# EAGLE design Adafruit Feather 328P (EAGLE 9.6.2)
COMPANY: ADAFRUIT INDUSTRIES; DRAWN: KTOWN; REV: B
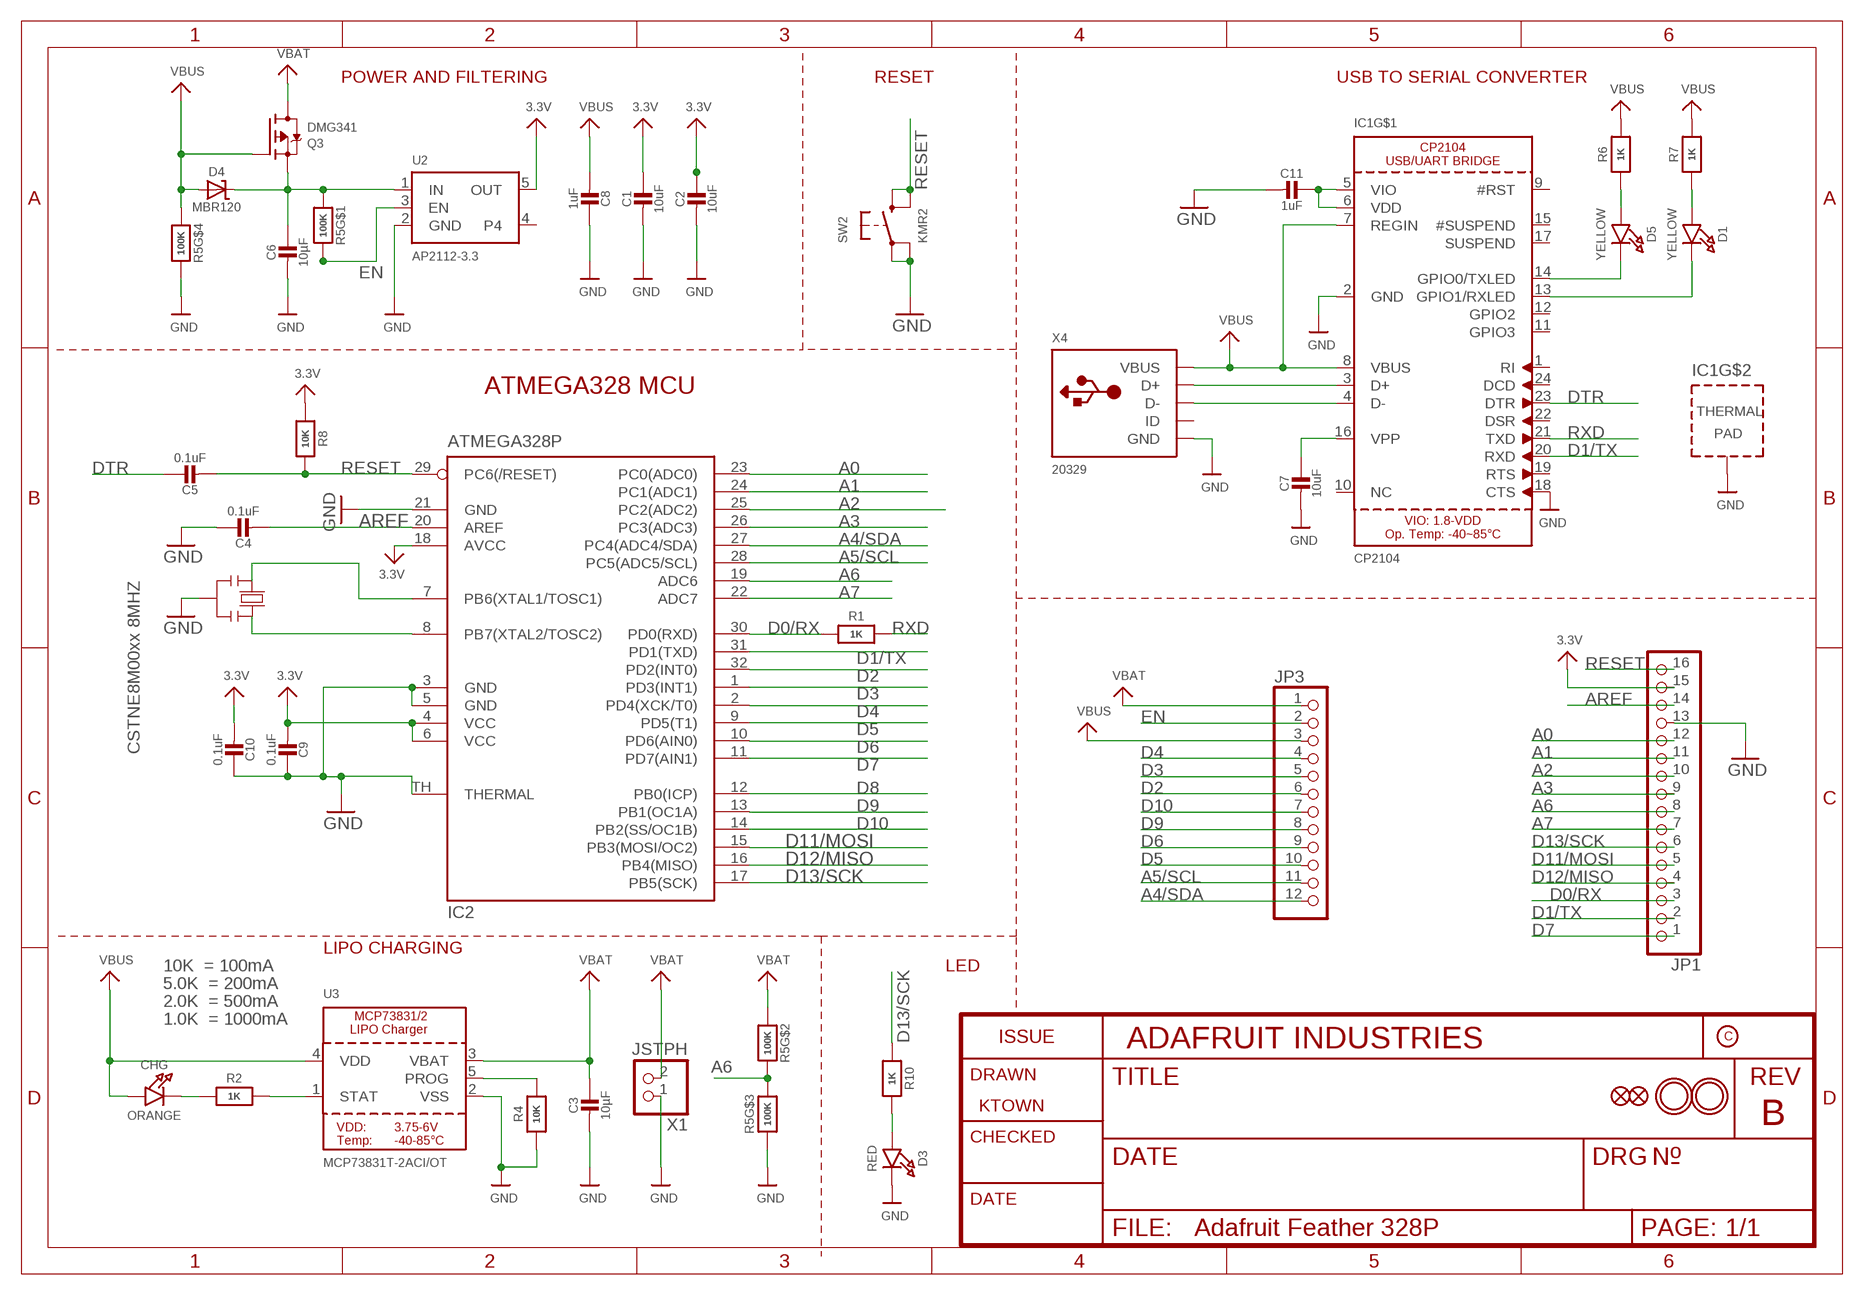
[diagram p0: schematic, sheet 1]

## Parts
C1  10uF  CAP_CERAMIC0805-NOOUTLINE  [0805-NO]
C2  10uF  CAP_CERAMIC0805-NOOUTLINE  [0805-NO]
C3  10µF  CAP_CERAMIC0805-NOOUTLINE  [0805-NO]
C4  0.1uF  CAP_CERAMIC0603_NO  [0603-NO]
C5  0.1uF  CAP_CERAMIC0603_NO  [0603-NO]
C6  10µF  CAP_CERAMIC0805-NOOUTLINE  [0805-NO]
C7  10uF  CAP_CERAMIC_0805MP  [_0805MP]
C8  1uF  CAP_CERAMIC0603_NO  [0603-NO]
C9  0.1uF  CAP_CERAMIC0603_NO  [0603-NO]
C10  0.1uF  CAP_CERAMIC0603_NO  [0603-NO]
C11  1uF  CAP_CERAMIC0603_NO  [0603-NO]
CHG  ORANGE  LED0805_NOOUTLINE  [CHIPLED_0805_NOOUTLINE]
D1  YELLOW  LED0805_NOOUTLINE  [CHIPLED_0805_NOOUTLINE]
D3  RED  LED0805_NOOUTLINE  [CHIPLED_0805_NOOUTLINE]
D4  MBR120  DIODE-SCHOTTKYSOD-123  [SOD-123]
D5  YELLOW  LED0805_NOOUTLINE  [CHIPLED_0805_NOOUTLINE]
IC1  CP2104  [QFN24_4MM_SMSC]
IC2  ATMEGA328P  MEGA8-MI  [MLF32-TH]
JP1  HEADER-1X16ROUND  [1X16_ROUND]
JP3  HEADER-1X12  [1X12_ROUND]
Q3  DMG341  MOSFET-P  [SOT23-R]
R1  1K  RESISTOR_0603MP  [_0603MP]
R2  1K  RESISTOR_0603_NOOUT  [0603-NO]
R4  10K  RESISTOR_0603_NOOUT  [0603-NO]
R5  100K  RESISTOR_4PACK  [RESPACK_4X0603]
R6  1K  RESISTOR_0603_NOOUT  [0603-NO]
R7  1K  RESISTOR_0603_NOOUT  [0603-NO]
R8  10K  RESISTOR_0603_NOOUT  [0603-NO]
R10  1K  RESISTOR_0603_NOOUT  [0603-NO]
SW2  KMR2  SWITCH_TACT_SMT4.6X2.8  [BTN_KMR2_4.6X2.8]
U2  AP2112-3.3  VREG_SOT23-5  [SOT23-5]
U3  MCP73831T-2ACI/OT  MCP73831/2  [SOT23-5]
U$31  MOUNTINGHOLE2.5  [MOUNTINGHOLE_2.5_PLATED]
U$32  MOUNTINGHOLE2.5  [MOUNTINGHOLE_2.5_PLATED]
U$34  FIDUCIAL_1MM  [FIDUCIAL_1MM]
U$35  FIDUCIAL_1MM  [FIDUCIAL_1MM]
X1  JSTPH  CON_JST_PH_2PIN  [JSTPH2]
X4  20329  USB_MICRO_20329_V2  [4UCONN_20329_V2]
Y2  CSTNE8M00xx 8MHZ  RESONATORMU  [RESONATOR]

## Nets
3.3V: C1.1 C2.1 C9.2 C10.2 IC2.4(VCC) IC2.6(VCC) IC2.18(AVCC) JP1.15 R8.2 U2.5(OUT)
A0: IC2.23(PC0(ADC0)) JP1.12
A1: IC2.24(PC1(ADC1)) JP1.11
A2: IC2.25(PC2(ADC2)) JP1.10
A3: IC2.26(PC3(ADC3)) JP1.9
A4/SDA: IC2.27(PC4(ADC4/SDA)) JP3.12
A5/SCL: IC2.28(PC5(ADC5/SCL)) JP3.11
A6: IC2.19(ADC6) JP1.8 R5.6 R5.7
A7: IC2.22(ADC7) JP1.7
AREF [aref]: C4.2 IC2.20(AREF) JP1.14
D0/RX: IC2.30(PD0(RXD)) JP1.3 R1.1
D1/TX: IC1.20(RXD) IC2.31(PD1(TXD)) JP1.2
D2: IC2.32(PD2(INT0)) JP3.6
D3: IC2.1(PD3(INT1)) JP3.5
D4: IC2.2(PD4(XCK/T0)) JP3.4
D5: IC2.9(PD5(T1)) JP3.10
D6: IC2.10(PD6(AIN0)) JP3.9
D7: IC2.11(PD7(AIN1)) JP1.1
D8: IC2.12(PB0(ICP))
D9: IC2.13(PB1(OC1A)) JP3.8
D10: IC2.14(PB2(SS/OC1B)) JP3.7
D11/MOSI: IC2.15(PB3(MOSI/OC2)) JP1.5
D12/MISO: IC2.16(PB4(MISO)) JP1.4
D13/SCK: IC2.17(PB5(SCK)) JP1.6 R10.1
DTR: C5.1 IC1.23(DTR)
EN: JP3.2 R5.8 U2.3(EN)
GND: C1.2 C2.2 C3.2 C4.1 C6.2 C7.2 C8.1 C9.1 C10.1 C11.2 D3.C IC1.2(GND) IC1.18(CTS) IC1.THERM(TP) IC2.3(GND) IC2.5(GND) IC2.21(GND) IC2.TH(THERMAL) JP1.13 R4.1 R5.3 R5.5 SW2.A'(P1) SW2.A(P) U2.2(GND) U3.2(VSS) X1.1 X4.BASE@1(GND) X4.BASE@2(GND) X4.GND X4.SPRT@1(GND) X4.SPRT@2(GND) X4.SPRT@3(GND) X4.SPRT@4(GND) Y2.2
N$1: CHG.C R2.1
N$2: IC1.3(D+) X4.D+
N$3: R2.2 U3.1(STAT)
N$4: R4.2 U3.5(PROG)
N$5: D3.A R10.2
N$6: IC1.4(D-) X4.D-
N$7: C6.1 D4.C Q3.2(S) R5.1 U2.1(IN)
N$8: D1.A R7.1
N$9: D5.A R6.1
N$10: C11.1 IC1.5(VIO) IC1.6(VDD)
N$41: C7.1 IC1.16(VPP)
RESET: C5.2 IC2.29(PC6(/RESET)) JP1.16 R8.1 SW2.B'(S1) SW2.B(S)
RXD: IC1.21(TXD) R1.2
RXLED: D1.C IC1.13(GPIO1/RXLED)
TXLED: D5.C IC1.14(GPIO0/TXLED)
VBAT: C3.1 JP3.1 Q3.3(D) R5.2 U3.3(VBAT) X1.2
VBUS: C8.2 CHG.A D4.A IC1.7(REGIN) IC1.8(VBUS) JP3.3 Q3.1(G) R5.4 R6.2 R7.2 U3.4(VDD) X4.VBUS
XTAL1: IC2.8(PB7(XTAL2/TOSC2)) Y2.3
XTAL2: IC2.7(PB6(XTAL1/TOSC1)) Y2.1
Unconnected: IC1.1(RI) IC1.9(#RST) IC1.10(NC) IC1.11(GPIO3) IC1.12(GPIO2) IC1.15(#SUSPEND) IC1.17(SUSPEND) IC1.19(RTS) IC1.22(DSR) IC1.24(DCD) U2.4 X4.ID

## Notes on the sheet
- POWER AND FILTERING | RESET | USB TO SERIAL CONVERTER
- ATMEGA328 MCU
- LIPO CHARGING
- 10K  = 100mA | LED
- 5.0K  = 200mA
- 2.0K  = 500mA
- 1.0K  = 1000mA

## Library data of the parts
C1-C11 = microbuilder:CAP_CERAMIC: Ceramic Capacitors For new designs, use the packages preceded by an '_' character since they are more reliable: The following footprints should be used on most boards: _0402 - Standard footprint for regular board layouts _0603 - Standard footprint for regular board layouts _0805 - Standard footprint for regular board layouts _1206 - Standard footprint for regular board layouts For extremely tight-pitch boards where space is at a premium, the following 'micro-pitch' footprints can be used (smaller pads, no silkscreen outline, etc.): _0402MP - Micro-pitch footprint for very dense/compact boards _0603MP - Micro-pitch footprint for very dense/compact boards _0805MP - Micro-pitch footprint for very dense/compact boards _1206MP - Micro-pitch footprint for very dense/compact boards
CHG D1 D3 D5 = microbuilder:LED: LED 0603 - 0603 Surface Mount Package 2mA: Green LED - Low Power (3.9mcd, 2ma, 1.7Vf) - Digikey: 475-2709-2-ND Orange LED - Low Power (9.8mcd, 2ma, 1.8Vf) - Digikey: 475-1194-2-ND Red LED - Low Power (5mcd, 2ma, 1.8Vf) - Digikey: 475-1195-2-ND Yellow LED - Low Power (7mcd, 2ma, 1.8Vf) - Digikey: 475-1196-2-ND 5mA: Blue LED - Low Power (17mcd, 5ma, 2.9Vf) - Digikey: LNJ937W8CRACT-ND 0805 - 0805 Surface Mount Package 2mA: Red LED (8.8mcd, 2mA, 1.8Vf, Clear) - Low Power [Digikey: 475-2510-1-ND] Green LED (5mcd, 2mA, 1.8Vf, Clear) - Low Power [Digikey: 475-2730-1-ND] Yellow LED (11.3mcd, 2mA, 1.8Vf, Clear) - Low Power [Digikey: 475-2555-1-ND] 20mA: Red LED (104mcd, 20mA, Diffused) - LS R976 [Digikey: 475-1278-6-ND] Red LED (12mcd, 20mA, 2.0Vf, Clear) - APT2012EC [Digikey: 754-1128-1-ND] Green LED (15mcd, 20mA, 2.2Vf, Clear) - APT2012GC [Digikey: 754-1131-1-ND] Orange LED (160mcd, 20mA, 2.1Vf, Clear) - APT2012SECK [Digikey: 754-1130-1-ND] 1206 - 1206 Surface Mount Package Green LED (26mcd, 20mA, Diffused) - LG N971 [Digikey: 475-1407-6-ND] Red LED (15mcd, 20mA, Diffused) - LH N974 [Digikey: 475-1416-6-ND] Cree - Cree High-Power Surface Mount LEDs XPEBWT-L1-0000-00D50 - White 111lm 350mA 2.9Vf 6200K 110° XTEAWT-00-0000-00000LEE3 - White 114lm 350mA 2.85Vf 5000K 115° Everlight - Everlight 45-21 Series Surface Mount LEDs 45-21/QK2C-B2832AC2CB2/2T - Warm White 2000mcd 20mA 3.25Vf 3050K 120° 45-21/LK2C-B38452C4CB2/2T - Nuetral White 2000mcd 20mA 3.25Vf 4150K 120° 45-21/LK2C-B50634C6CB2/2T - Cold White 2200mcd 20mA 3.25Vf 5650K 120° PLCC2 Reverse Mount LS T77K-J1L2-1-0-2-R18-Z - Red 11.25mcd 2mA 1.8Vf 630nm 120° LO T77K-L1M2-24-Z - Orange 19.6mcd 2mA 1.8Vf 606nm 120° LY T77K-K2M1-26-Z - Yellow 15.7mcd 2mA 1.8Vf 587nm 120°
D4 = microbuilder:DIODE-SCHOTTKY
IC1 = microbuilder:CP2104: CP2104 - USB to UART Bridge VDD Output: 3.45V
IC2 = microbuilder:MEGA8-MI: MICROCONTROLLER 8 Kbytes FLASH, 1 kbytes SRAM, 512 bytes EEPROM, USART, 6-channel 10 bit ADC, 2-channel 8 bit ADC Pin compatible with Atmega48, ATMega88, ATMega168 Source: avr.lbr; MPN: ATMEGA88PA-MU; OC_FARNELL: 1715491; OC_NEWARK: 15R0272
JP1 = microbuilder:HEADER-1X16: PIN HEADER
JP3 = microbuilder:HEADER-1X12
Q3 = microbuilder:MOSFET-P: P-Channel Mosfet LEGEND VDS: Voltage Drain-Source ID: Drain Current RDS(ON): Drain-Source On-State Resistance VGS(TH): Gate-Source Threshold Voltage CISS: Drain-Source Input Capacitance SOT-23 Name VDS ID RDS(ON) VGS(TH) CISS Order Number IRLML5103 30V 760mA 600 mOhm -- 75pF @ 25V Digikey: IRLML5103PBFCT-ND IRLML6401 12V 4.3A 50 mOhm 950mV @ 250µA 830pF @ 10V Digikey: IRLML6401PBFTR-ND NTR0202PL 20V 400mA 800 mOhm 2.3V @ 250uA 70pF @ 5V Digikey: NTR0202PLT1GOSTR-ND NTR4101PT1G 20V 1.8A 85 mOhm 1.2V @ 250uA 675pF @ 10V Digikey: NTR4101PT1GOSCT-ND DMP2004K 20V 600mA 900 mOhm 1V @ 250uA 175pF @ 16V Digikey: DMP2004KDICT-ND PMV65XP 20V 3.9A 76 mOhm 950mV @ 1mA 725pF @ 20V Digikey: 568-2358-2-ND TO-252 Name VDS ID RDS(ON) VGS(TH) CISS Order Number AOD417 30V 25A 34 mOhm 3V @ 250µA 920pF @ 15V Digikey: 785-1106-2-ND PowerPak Name VDS ID RDS(ON) VGS(TH) CISS Order Number AON7401 30V 12A 14 mOhm 3V @ 250µA 2600pF @ 15V Digikey: 785-1302-1-ND
R1 R2 R4 R6-R8 R10 = microbuilder:RESISTOR: Resistors For new designs, use the packages preceded by an '_' character since they are more reliable: The following footprints should be used on most boards: _0402 - Standard footprint for regular board layouts _0603 - Standard footprint for regular board layouts _0805 - Standard footprint for regular board layouts _1206 - Standard footprint for regular board layouts For extremely tight-pitch boards where space is at a premium, the following 'micro-pitch' footprints can be used (smaller pads, no silkscreen outline, etc.): _0402MP - Micro-pitch footprint for very dense/compact boards _0603MP - Micro-pitch footprint for very dense/compact boards _0805MP - Micro-pitch footprint for very dense/compact boards _1206MP - Micro-pitch footprint for very dense/compact boards
R5 = microbuilder:RESISTOR_4PACK: Resistor Packs (4 resistors) 4 x 0603 10K 1/16W - Digikey: YC164J-10KCT-ND
SW2 = microbuilder:SWITCH_TACT_SMT: SMT Tact Switches 6x6mm - Digikey: P12940SCT-ND KMR2 (4.6x2.8mm) - Digikey: 401-1426-1-ND EVQ-PQHB55 - Light Touch, 160GF (4.5x4.5mm) - Digikey: P8090SCT-ND KMT0 - KMT021 NGJ LHS (etc.) IP68/Waterproof - Digikey: CKN10289CT-ND
U2 = microbuilder:VREG_SOT23-5: SOT23-5 Fixed Voltage Regulators Part Current Out V Out V In V Dropout θJA (°C/W) TJ (°C) Digikey Part No. ADP121 150mA 3.3V 3.4-5.5V 0.09V @ 150mA -- -- ADP121-AUJZ33R7CT-ND ADP121 150mA 3.0V 3.1-5.5V 0.09V @ 150mA -- -- ADP121-AUJZ30R7CT-ND ADP122 300mA 3.3V 3.4-5.5V 0.085V @ 300mA -- -- ADP122AUJZ-3.3-R7CT-ND ADP1712 300mA 3.3V 3.5-5.5V 0.17V @ 300mA -- -- ADP1712AUJZ-3.3-R7TR-ND AP7311 (Low Cost) 150mA 3.3V 3.5-6V 0.15V @ 150mA -- -- AP7311-33WG-7DICT-ND LD39015M18R 150mA 1.8V 1.9V-5.5V 0.08V @ 100mA -- -- 497-6977-1-ND LP2985A-33DBVR 150mA 3.3V 3.3-16V 0.28V @ 150mA 206 150 296-18479-1-ND MCP1824T-3302E/OT 300mA 3.3V 3.5V-6V 0.2V @ 300mA -- -- MCP1824T-3302E/OTCT-ND MIC5205-2.5YM5 TR 150mA 2.5V 2.7-16V 0.165V @ 150mA -- -- 576-1257-2-ND MIC5205-3.0YM5 TR 150mA 3.0V 3.2V-16V 0.165V @ 150mA -- -- 576-1258-2-ND MIC5205-3.3YM5 TR 150mA 3.3V 3.5V-16V 0.165V @ 150mA -- -- 576-1259-2-ND TPS780330220 150mA 3.3V+2.2V 3.6-5.5V 250mV Max -- -- 296-23332-1-ND TDA3663/N1,135 100mA 3.3V 3.5-45V 0.18V @ 50mA -- -- 568-5343-1-ND Max operating temp can be calculated using θJA, TJ (max junction temperature), and power in watts. Set the "Maximum Ambient Temperature" until it reaches TJ ("Max Junction Temperature"), which is the absolute limit for safe use of the regulator: Heat Sink Temperature Calculator <http://www.daycounter.com/Calculators/Heat-Sink-Temperature-Calculator.phtml> For example, With 12V source into a 3.3V LP2985 and a 30mA load, we are dissipating (12V-3.3V) * 0.03A = 0.261W. With a θJA of 206 °C/W, a TJ of 150°C, and 261mW we can safely use the chip without a heat sink up to 75°C (=147.1°C Junction Temperature).
U3 = microbuilder:MCP73831/2: MCP73831/2 LIPO Charger VDD: 3.75 - 6V Temp -40 - 85°C Programmable Charge Rate: 15-500mA NOTE: STAT is a tri-state logic output on the MCP73831 and an open-drain output on the MCP73832. SOT23-5 with 4.2V output and tri-state logic on STAT = MCP73831T-2ACI/OT
U$31 U$32 = microbuilder:MOUNTINGHOLE: Mounting Hole For #2 screws (0.086"/2.18mm width, 0.094"/2.4mm hole) use 2.5mm; BOM: EXCLUDE
U$34 U$35 = microbuilder:FIDUCIAL: Fiducial Alignment Points Various fiducial points for machine vision alignment.; BOM: EXCLUDE
X1 = microbuilder:CON_JST_PH_2PIN: JST 2-Pin Right-Angle Connector PH-Series - 4UConnector: 17311 SH-Series - 4UConnector: 07278
X4 = microbuilder:USB: USB Connectors USBMINIB - Surface Mount Female Mini-B USB Connector 4UConnector: 06564
Y2 = SmartPrj:RESONATOR

## Net classes
1 power: width 0.305 mm, drill 0.483 mm, clearance 0.203 mm
2 gnd: width 0.305 mm, drill 0.483 mm, clearance 0.203 mm
3 usbvcc: width 0.305 mm, drill 0.483 mm, clearance 0.203 mm
4 aref: width 0.254 mm, drill 0.483 mm, clearance 0.203 mm

## Board
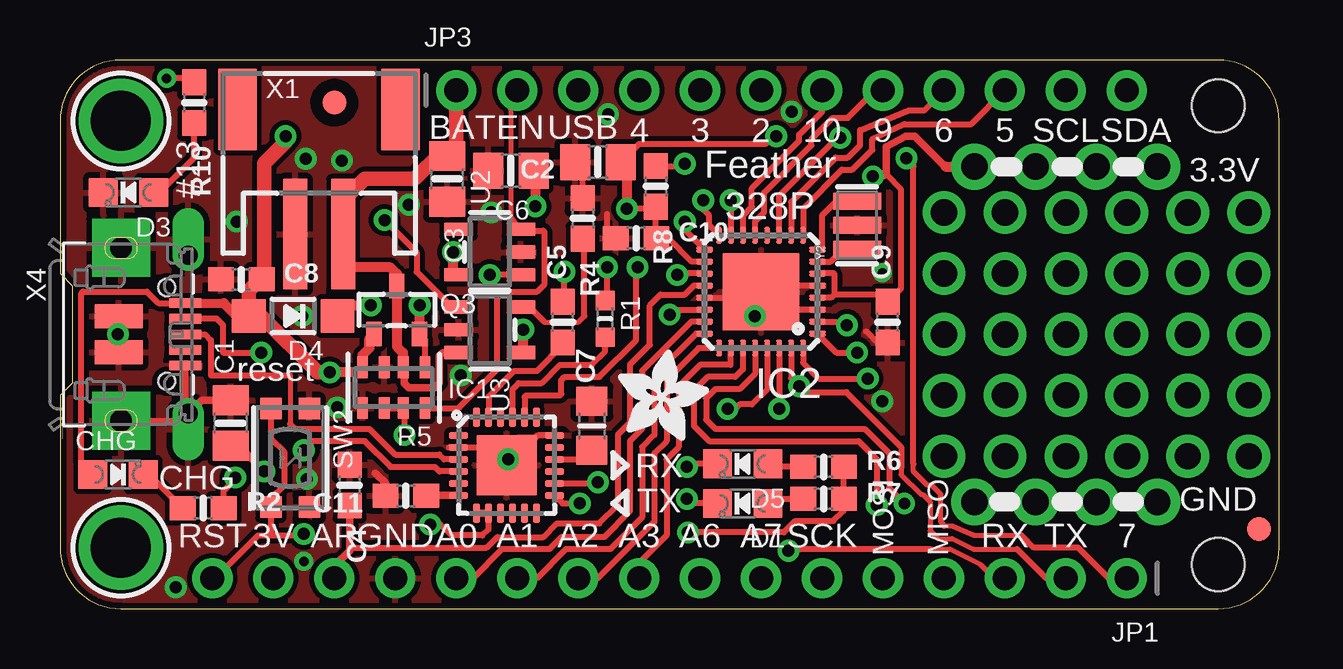
[diagram p1: board, top side]
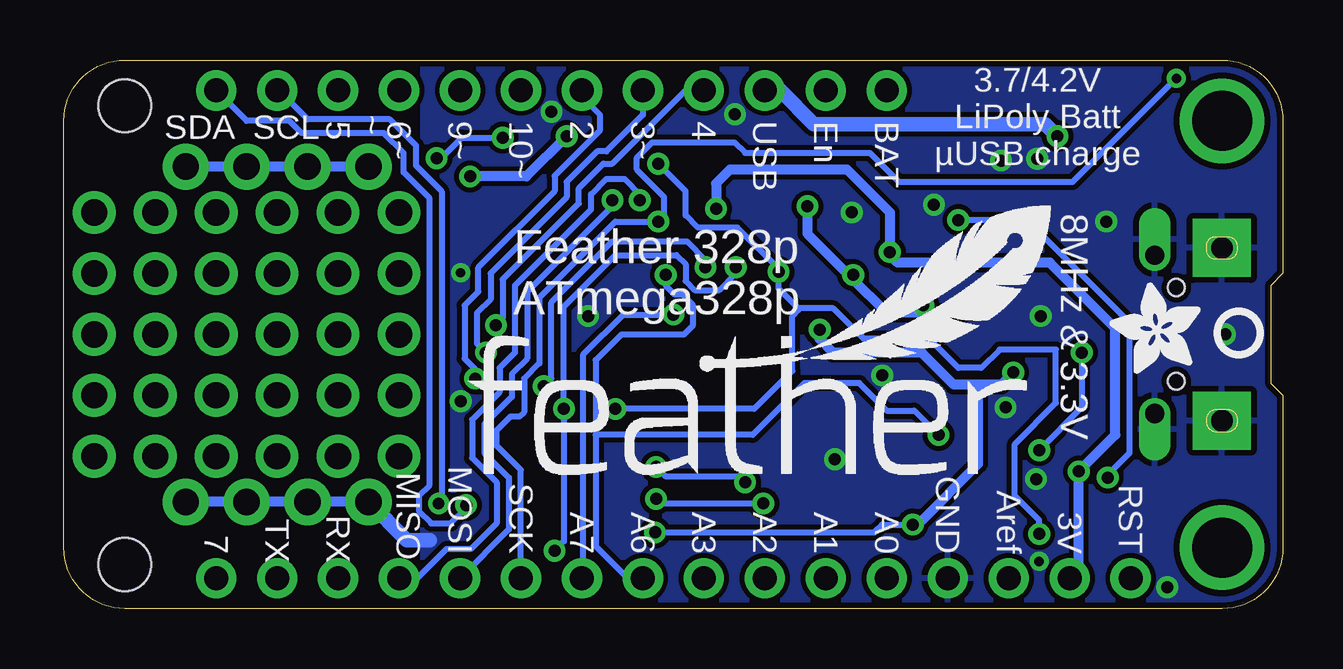
[diagram p2: board, bottom side, seen from below]

Size 50.8 x 22.86 mm. Coordinates in mm from the lower left corner, seen from the top.
Outline: 2.54,0 48.26,0 arc90 50.8,2.54 50.8,20.32 arc90 48.26,22.86 2.54,22.86 arc90 0,20.32 0,13.97 0.51,13.46 0.51,9.4 0,8.89 0,2.54 arc90 2.54,0
Copper layers (1*16): Top 0.035mm / dielectric 1.5mm / Bottom 0.035mm
Design rules "adafruit *": minimum track width 8mil, minimum drill 15.5mil, track to track 8mil, track to pad 8mil, pad to pad 8mil, via to via 8mil, smd to smd 8mil, copper to edge 10mil, drill to drill 8mil, minimum pad ring 10mil, minimum via ring 8mil, stop-mask expansion 2mil, vias tented up to drill 20mil, thermal gap 10mil
Holes 2.2 mm at 48.26,1.84 48.26,20.95

### Footprints (pad centres in the part's own frame; a part is rotated, then mirrored left to right if it is on the bottom)
0805-NO = smd 1.24 x 1.5: 1 -0.95,0; 2 0.95,0
0603-NO = smd 1.075 x 1: 1 -0.85,0; 2 0.85,0
_0805MP = smd 1.2 x 1.3: 1 -1.016,0; 2 1.016,0
CHIPLED_0805_NOOUTLINE = smd 1.2 x 1.2: A 0,-1.05; C 0,1.05
SOD-123 = smd 1.4 x 1.4: A 1.85,0; C -1.85,0
QFN24_4MM_SMSC = smd 0.8 x 0.28: 1 -2,1.25; 2 -2,0.75; 3 -2,0.25; 4 -2,-0.25; 5 -2,-0.75; 6 -2,-1.25; 13 2,-1.25; 14 2,-0.75; 15 2,-0.25; 16 2,0.25; 17 2,0.75; 18 2,1.25 | smd 0.28 x 0.8: 7 -1.25,-2; 8 -0.75,-2; 9 -0.25,-2; 10 0.25,-2; 11 0.75,-2; 12 1.25,-2; 19 1.25,2; 20 0.75,2; 21 0.25,2; 22 -0.25,2; 23 -0.75,2; 24 -1.25,2 | smd 2.5 x 2.5: THERM 0,0
MLF32-TH = smd 0.7 x 0.25: 1 -2.35,1.75; 2 -2.35,1.25; 3 -2.35,0.75; 4 -2.35,0.25; 5 -2.35,-0.25; 6 -2.35,-0.75; 7 -2.35,-1.25; 8 -2.35,-1.75; 17 2.35,-1.75; 18 2.35,-1.25; 19 2.35,-0.75; 20 2.35,-0.25; 21 2.35,0.25; 22 2.35,0.75; 23 2.35,1.25; 24 2.35,1.75 | smd 0.25 x 0.7: 9 -1.75,-2.35; 10 -1.25,-2.35; 11 -0.75,-2.35; 12 -0.25,-2.35; 13 0.25,-2.35; 14 0.75,-2.35; 15 1.25,-2.35; 16 1.75,-2.35; 25 1.75,2.35; 26 1.25,2.35; 27 0.75,2.35; 28 0.25,2.35; 29 -0.25,2.35; 30 -0.75,2.35; 31 -1.25,2.35; 32 -1.75,2.35 | smd 3.2 x 3.2: TH 0,0
1X16_ROUND = drill 1 pad 1.676: 1 -19.05,0; 2 -16.51,0; 3 -13.97,0; 4 -11.43,0; 5 -8.89,0; 6 -6.35,0; 7 -3.81,0; 8 -1.27,0; 9 1.27,0; 10 3.81,0; 11 6.35,0; 12 8.89,0; 13 11.43,0; 14 13.97,0; 15 16.51,0; 16 19.05,0
1X12_ROUND = drill 1 pad 1.676: 1 -13.97,0; 2 -11.43,0; 3 -8.89,0; 4 -6.35,0; 5 -3.81,0; 6 -1.27,0; 7 1.27,0; 8 3.81,0; 9 6.35,0; 10 8.89,0; 11 11.43,0; 12 13.97,0
SOT23-R = smd 0.635 x 1.016: 1 -0.95,-1; 2 0.95,-1; 3 0,1
_0603MP = smd 0.8 x 0.8: 1 -0.762,0; 2 0.762,0
RESPACK_4X0603 = smd 0.45 x 0.9: 1 -1.3,-0.85; 2 -0.4,-0.85; 3 0.4,-0.85; 4 1.3,-0.85; 5 1.3,0.85; 6 0.4,0.85; 7 -0.4,0.85; 8 -1.3,0.85
BTN_KMR2_4.6X2.8 = smd 0.9 x 0.9: A 2.05,0.8; A' -2.05,0.8; B 2.05,-0.8; B' -2.05,-0.8
SOT23-5 = smd 0.55 x 1.2: 1 -0.95,-1.3; 2 0,-1.3; 3 0.95,-1.3; 4 0.95,1.3; 5 -0.95,1.3
MOUNTINGHOLE_2.5_PLATED = drill 2.5 pad 3.2: P$1 0,0
FIDUCIAL_1MM = smd 1 x 1: 1 0,0
JSTPH2 = smd 1 x 4.6: 1 -1,-3.7; 2 1,-3.7 | smd 1.6 x 3.4: NC1 -3.4,1.5; NC2 3.4,1.5
4UCONN_20329_V2 = smd 1 x 2: BASE@1 -0.75,-2; BASE@2 0.75,-2 | smd 0.4 x 1.35: D+ 0,0.775; D- -0.65,0.775; GND 1.3,0.775; ID 0.65,0.775; VBUS -1.3,0.775 | drill 0.8 pad 1.143 offset: SPRT@1 -3.3,0.9; SPRT@2 3.3,0.9 | drill 0.9 pad 2.413 square: SPRT@3 -3.6,-1.9; SPRT@4 3.6,-1.9 | hole 0.7: -1.95,0; 1.95,0
RESONATOR = smd 0.7 x 2: 1 -1,0; 2 0,0; 3 1,0

### Placement (x,y rotation side)
C1  7.11,7.73 90 top
C2  22.42,18.61 180 top
C3  16.13,17.91 270 top
C4  12.06,5.14 270 top
C5  20.95,11.94 90 top
C6  18.79,18.25 180 top
C7  22.16,7.62 90 top
C8  7.56,13.72 0 top
C9  34.48,11.94 90 top
C10  24,15.43 0 top
C11  14.41,4.7 180 top
CHG  2.41,5.59 270 top
D1  28.45,4.38 90 top
D3  2.86,17.34 90 top
D4  9.72,12.19 180 top
D5  28.45,6.03 90 top
IC1  18.61,5.97 0 top
IC2  29.21,13.21 180 top
JP1  25.4,1.27 180 top
JP3  30.48,21.59 0 top
Q3  14.03,12.45 0 top
R1  22.71,12.08 270 top
R2  5.97,4.19 0 top
R4  21.78,16.26 270 top
R5  13.91,9.21 180 top
R6  31.81,5.91 0 top
R7  31.81,4.57 0 top
R8  24.83,17.59 270 top
R10  5.59,21.08 270 top
SW2  9.59,6.29 270 top
U2  17.91,14.86 90 top
U3  17.91,11.62 270 top
U$9  [FEATHERLOGO]  33.97,5.52 0 bottom
U$13  [PCBFEAT-REV-040]  1.84,11.49 0 bottom
U$15  [ADAFRUIT_3.5MM]  23.24,6.99 0 top
U$31  2.54,20.32 270 top
U$32  2.54,2.54 270 top
U$34  11.43,21.08 270 top
U$35  49.96,3.31 270 top
U$44  [ADAFRUIT_3.5MM]  3.43,9.78 90 bottom
X1  10.79,19.3 0 top
X4  4.45,11.43 270 top
Y2  33.21,15.98 90 top

### Tracks (layer width: path | path; a pad name or v marks a point on that pad's centre or on a via)
3.3V  (via drill 0.5, 1.1 pad 1.93)
  Top 0.254: IC2.18 26.31,14.46 25.34,15.43 C10.2 24.83,15.46 R8.2 24.75,16.66 v23.62,16.66 | C2.1 24.13,19.37 29.4,19.37 29.72,19.68 v29.84,19.68 | IC2.6 32.26,13.97 32.26,13.08 | 32.26,13.08 32.13,12.95 IC2.4 | 32.26,13.08 34.19,13.08 C9.2 35.05,13.36 35.05,17.46 34.42,18.1 34.33,18.01 v33.87,18.01
  Top 0.305: 34.42,18.1 34.42,19.24 35.24,19.68 35.62,19.68 36.89,18.41 | C1.1 7.44,6.78 v8.51,5.71
  Top 0.406: v16.38,14.86 16.38,14.13 U2.5 | 36.89,18.41 v38.1,18.41 | C2.1 23.62,18.35 v23.62,16.66
  Bottom 0.406: 23.6,16.66 v23.62,16.66 23.62,17.72 23.05,18.29 18.16,18.29 16.38,16.51 v16.38,14.86 16.38,14.73 16.07,14.41 9.72,14.41 6.99,11.68 6.99,7.24 v8.51,5.71 8.51,1.65 JP1.15 | v29.84,19.68 31.52,18.01 v33.87,18.01 | v38.1,18.41 v40.64,18.41 v43.18,18.41 v45.72,18.41
A0
  Top 0.254: IC2.23 26.31,11.96 24.26,9.91 24.26,7.49 23.75,6.99 23.75,4.06 22.67,2.98 20.89,2.98 20.38,2.48 18.41,2.48 17.21,1.27 JP1.12
A1
  Top 0.254: IC2.24 26.51,11.46 24.77,9.72 24.77,7.24 24.26,6.73 24.26,3.81 22.92,2.48 21.08,2.48 19.88,1.27 JP1.11
A2
  Top 0.254: IC2.25 26.61,10.86 25.27,9.53 25.27,6.99 24.77,6.48 24.77,3.62 22.42,1.27 JP1.10
A3
  Top 0.254: IC2.26 27.94,10.84 27.94,10.16 26.67,10.16 25.78,9.27 25.78,6.73 25.27,6.22 25.27,3.05 24.13,1.91 JP1.9
A4/SDA  (via drill 0.5)
  Top 0.254: IC2.27 28.45,10.85 28.45,9.97 28.13,9.65 26.99,9.65 26.42,9.08 26.42,7.62 27.05,6.99 33.27,6.99 34.04,6.22 v34.04,4.32
  Bottom 0.254: JP3.12 43.18,20.32 41.4,20.32 40.89,19.81 37.47,19.81 36.64,18.99 36.64,18.17 35.56,17.09 35.56,5.14 36.01,4.7 36.01,4.06 35.5,3.56 34.67,3.56 34.04,4.19 v34.04,4.32
A5/SCL  (via drill 0.48)
  Top 0.254: IC2.28 28.96,9.78 28.32,9.14 27.3,9.14 26.92,8.76 26.92,7.87 27.3,7.49 33.53,7.49 34.54,6.48 34.54,5.02 v35.18,4.38
  Bottom 0.254: JP3.11 41.85,21.59 40.64,20.38 37.21,20.38 36.13,19.3 36.13,18.47 35.05,17.39 35.05,4.51 v35.18,4.38
A6  (via drill 0.5)
  Top 0.254: IC2.19 26.85,13.97 25.65,13.97 v25.72,13.91 | R5.6 R5.7 14.35,8.31 v14.35,7.24
  Bottom 0.254: 28.64,7.24 28.64,10.35 27.56,11.43 24.96,11.43 24.57,11.81 24.57,12.64 25.02,13.08 25.34,13.08 25.72,13.46 v25.72,13.91 | 28.64,7.24 28.64,2.6 27.3,1.27 JP1.8 | 28.64,7.24 22.1,7.24 19.94,9.4 17.65,9.4 16.51,8.26 15.37,8.26 v14.35,7.24
A7  (via drill 0.5)
  Top 0.254: IC2.22 25.6,12.46 v25.4,12.26
  Bottom 0.254: JP1.7 29.15,1.33 29.15,10.6 27.5,12.26 v25.4,12.26
AREF
  Top 0.254: JP1.14 11.43,1.78 12.19,2.54 13.21,2.54 | 13.21,2.54 17.78,2.54 18.22,2.98 20.13,2.98 20.7,3.56 22.48,3.56 23.24,4.32 23.24,7.24 23.75,7.75 23.75,10.16 24.57,10.99 24.57,12.64 25.02,13.08 26.04,13.08 26.41,13.46 IC2.20 | 13.25,2.58 13.21,2.54
  Top 0.305: C4.2 12.06,2.41 11.43,1.78
D0/RX  (via drill 0.5)
  Top 0.203: 36.26,2.48 37.08,2.48 38.35,1.84 38.92,1.27 JP1.3
  Top 0.254: 36.26,2.48 30.42,2.48 v30.35,2.41 | IC2.30 v29.96,8.33 | R1.1 22.8,12.92 v22.8,14.22
  Bottom 0.254: v30.35,2.41 29.96,2.81 v29.96,8.33 29.96,12.59 27.81,14.73 25.27,14.73 24.89,14.35 24.89,13.65 24.51,13.27 23.5,13.27 22.8,13.97 v22.8,14.22
D1/TX  (via drill 0.5)
  Top 0.203: 35.05,5.84 35.05,5.59 35.88,4.76 35.94,4.76 36.26,4.45 36.26,3.24 36.58,2.92 37.17,2.92 38.06,2.48 39.88,2.48
  Top 0.254: IC2.31 30.46,9.61 v30.8,9.27 31.05,9.02 32.77,9.02 35.05,6.73 35.05,5.84 | 41.53,1.27 JP1.2 41.08,1.27 39.88,2.48 | IC1.20 19.36,8.83 19.42,8.89 20.83,8.89 20.89,8.95 20.89,9.53 21.02,9.65 22.48,9.65 24,11.18 24,14.16 v24.07,14.22
  Bottom 0.254: v30.8,9.27 30.48,9.59 30.48,12.76 27.94,15.3 24.83,15.3 24.07,14.54 v24.07,14.22
D2  (via drill 0.5)
  Top 0.254: v33.66,9.59 31.62,9.59 30.96,10.25 IC2.32
  Bottom 0.254: JP3.6 29.21,21.34 28.45,20.57 28.45,19.94 30.35,18.03 30.35,17.4 33.53,14.22 33.53,13.21 34.1,12.64 34.1,10.41 33.66,9.97 v33.66,9.59 33.66,9.72
D3  (via drill 0.5)
  Top 0.254: IC2.1 32.35,10.67 v33.21,10.67
  Bottom 0.254: JP3.5 26.67,20.57 28.19,19.05 28.57,19.05 29.84,17.78 29.84,17.14 33.02,13.97 33.02,12.89 33.59,12.32 33.59,11.05 v33.21,10.67
D4  (via drill 0.5)
  Top 0.254: IC2.2 32.68,11.96 32.68,11.92 v32.79,11.81
  Bottom 0.254: JP3.4 24.89,21.59 27.94,18.54 28.32,18.54 29.34,17.53 29.34,16.89 32.51,13.72 32.51,12.09 v32.79,11.81
D5
  Top 0.254: IC2.9 30.96,16.67 32.58,18.29 33.02,18.29 33.85,19.11 33.85,19.56 35.18,20.19 37.97,20.19 JP3.10
D6
  Top 0.254: IC2.10 30.46,16.93 32.32,18.8 32.83,18.8 33.34,19.3 33.34,19.94 35.37,20.77 36.01,20.77 JP3.9
D7  (via drill 0.5)
  Top 0.203: 40.07,3.05 38.1,3.05 37.21,3.43 36.83,3.43 36.83,3.49 36.7,3.62 36.7,4.76 36.32,5.14 36.13,5.14 35.56,5.71 35.56,6.03
  Top 0.254: IC2.11 29.96,17.2 32.38,19.62 v32.51,19.62 | JP1.1 43.69,1.27 42.42,2.54 40.58,2.54 40.07,3.05 | 35.56,6.03 35.56,18.41 35.27,18.71 v35.27,18.77
  Bottom 0.254: v35.27,18.77 35.08,18.77 34.23,19.62 v32.51,19.62
D9
  Top 0.254: IC2.13 28.96,16.13 29.34,16.51 29.34,17.34 31.3,19.3 31.3,19.56 32.19,20.45 32.83,20.45 33.97,21.59 JP3.8
D10
  Top 0.254: IC2.14 28.46,16.39 28.83,16.76 28.83,17.53 30.8,19.49 30.8,19.75 31.75,20.7 JP3.7
D11/MOSI  (via drill 0.5)
  Top 0.254: IC2.15 27.96,17 v27.94,17.02
  Bottom 0.254: v27.94,17.02 27.94,16.76 31.5,13.21 31.5,10.41 32.13,9.78 32.13,8.83 33.27,7.68 33.27,6.48 32.26,5.46 32.26,3.3 JP1.5
D12/MISO  (via drill 0.5)
  Top 0.254: IC2.16 27.05,15.97 27.05,16.38 26.8,16.64 v26.8,17.02
  Bottom 0.254: v26.8,17.02 26.8,17.27 27.43,17.91 28.19,17.91 28.83,17.27 28.83,16.64 32,13.46 32,10.67 32.64,10.03 32.64,9.02 33.78,7.87 33.78,6.29 32.77,5.27 32.77,3.56 33.85,2.48 34.86,2.48 36.07,1.27 JP1.4
D13/SCK  (via drill 0.39, 0.5)
  Top 0.254: R10.1 5.42,22.1 v4.45,22.1 | IC2.17 26.04,15.78 v26.04,16.13
  Bottom 0.254: v4.45,22.1 8.76,17.78 16,17.78 17.21,18.99 22.42,18.99 22.86,19.43 26.29,19.43 26.92,18.8 26.92,18.29 25.78,17.14 25.78,16.38 v26.04,16.13 27.81,16.13 30.99,12.95 30.99,10.22 31.62,9.59 31.62,8.19 31.81,8 32.19,8 32.77,7.43 32.77,6.79 31.75,5.78 JP1.6
DTR
  Top 0.254: IC1.23 17.86,8.84 18.92,9.91 19.88,9.91 20.95,10.99 C5.1
EN
  Top 0.203: 18.8,16.26 18.8,20.83
  Top 0.254: 18.8,20.83 19.05,21.08 JP3.2 | R5.8 15.24,8.36 15.24,8.32 16.56,8.32 16.64,8.38 18.22,9.97 18.22,12.95 18.48,13.21 19.88,13.21 20.19,13.53 20.19,15.68 20.13,15.75 19.39,15.75 U2.3 | 18.8,16.26 18.92,16.09 U2.3 | 19.21,15.94 U2.3 | 19.15,15.88 U2.3
GND  (via drill 0.39, 0.5, 1.1 pad 1.93)
  Top 0.254: 1.59,15.03 X4.SPRT@3 | X4.GND 5.22,8.26 X4.SPRT@2 5.04,7.83 X4.SPRT@4 | C3.2 16.58,16.96 | IC2.5 29.21,13.46 IC2.TH | IC2.21 29.21,12.96 IC2.TH | IC2.3 29.21,12.46 29.21,12.57 | 29.21,12.57 IC2.TH | 28.7,12.57 28.96,12.57 | 28.96,12.57 29.21,12.57 | v28.96,12.19 28.96,12.57 | C9.1 34.06,11.09 33.59,11.56 | 16.2,6.72 IC1.2 18.67,6.72 19.06,7.11 19.81,7.11 19.92,7.22 IC1.18 | R4.1 21.78,18.29 C2.2 | C10.1 22.8,15.43 22.8,16.45
  Top 0.305: C1.2 5.9,8.68 X4.SPRT@2 | C11.2 13.56,5.23 13.14,5.65
  Top 0.406: U2.2 19.49,14.86
  Bottom 0.406: v38.1,4.45 v40.64,4.45 v43.18,4.45 v45.72,4.45
  Bottom 0.61: v38.1,4.45 36.51,2.86 35.56,2.86
  other vias: 2.41,11.43 11.75,18.67 11.56,8.38 4.83,0.89 7.37,16.13 10.24,18.75 14.54,16.83 10.1,12.19 17.97,16.51 10.16,1.97 18.67,6.22 22.83,20.6 30.48,20.7 34.26,14 34.26,8.64 10.29,5.4 16.7,9.72
  pour Top: 0,22.86 0,0 35.81,0 35.81,22.86
  pour Bottom: 0,0 35.81,0 35.81,22.86 0,22.86
N$1
  Top 0.254: CHG.C 3.72,5.59 R2.1
N$2
  Top 0.203: 9.59,9.72 9.59,7.68
  Top 0.254: X4.D+ 6.04,11.43 6.29,11.19 6.29,9.72 9.59,9.72 | IC1.3 16.01,6.22 15.81,6.41 13.97,6.41 12.89,7.49 9.78,7.49 9.59,7.68
N$3  (via drill 0.5)
  Top 0.254: R2.2 6.82,4.91 7.3,5.4 v7.3,5.46 | v13.53,16.19 14.86,14.86 14.86,14.03 16.26,12.63 16.29,12.57 U3.1
  Bottom 0.254: v7.3,5.46 7.3,5.58 6.4,6.48 6.4,11.94 10.65,16.19 v13.53,16.19
N$4
  Top 0.203: 20.19,11.94 21.59,11.94 21.84,12.19
  Top 0.254: U3.5 19.56,12.57 20.19,11.94 | 21.84,12.19 21.84,15.34 R4.2
N$5
  Top 0.254: D3.A 4.13,17.34 5.59,18.8 R10.2
N$6  (via drill 0.5)
  Top 0.254: X4.D- 6.53,12.08 6.79,11.81 6.79,10.67 v8.38,10.67 | 10.41,6.86 v10.16,6.6 10.54,6.99 12.7,6.99 13.78,5.91 15.62,5.91 15.81,5.72 IC1.4
  Bottom 0.254: v8.38,10.67 8.38,8.38 v10.16,6.6
N$7  (via drill 0.5)
  Top 0.254: C6.1 19.81,18.05 | 19.05,13.91 18.04,13.91 v17.91,13.91 | Q3.2 15.21,11.22 R5.1
  Top 0.305: U2.1 19.05,13.91
  Top 0.406: 19.81,18.05 v19.81,16.76 | D4.C 12.01,12.64 v12.95,12.64 | Q3.2 14.99,11.57 v14.99,12.64
  Bottom 0.305: v17.91,13.91 18,13.81
  Bottom 0.406: v12.95,12.64 13.27,12.32 14.99,12.32 | 14.99,12.32 16.51,12.32 18,13.81 19.81,15.62 v19.81,16.76 | 14.99,12.32 v14.99,12.64
N$8
  Top 0.254: D1.A 29.69,4.57 R7.1
N$9
  Top 0.254: R6.1 29.62,5.91 D5.A
N$10
  Top 0.254: IC1.5 IC1.6
  Top 0.305: IC1.6 15.28,4.72 C11.1
N$11  (via drill 1.1 pad 1.78)
  other vias: 44.45,16.51
N$12  (via drill 1.1 pad 1.78)
  other vias: 44.45,13.97
N$13  (via drill 1.1 pad 1.78)
  other vias: 46.99,13.97
N$14  (via drill 1.1 pad 1.78)
  other vias: 46.99,16.51
N$16  (via drill 1.1 pad 1.78)
  other vias: 49.53,16.51
N$17  (via drill 1.1 pad 1.78)
  other vias: 49.53,13.97
N$18  (via drill 1.1 pad 1.78)
  other vias: 49.53,11.43
N$19  (via drill 1.1 pad 1.78)
  other vias: 49.53,8.89
N$20  (via drill 1.1 pad 1.78)
  other vias: 46.99,8.89
N$21  (via drill 1.1 pad 1.78)
  other vias: 46.99,11.43
N$22  (via drill 1.1 pad 1.78)
  other vias: 44.45,11.43
N$23  (via drill 1.1 pad 1.78)
  other vias: 44.45,8.89
N$24  (via drill 1.1 pad 1.78)
  other vias: 44.45,6.35
N$25  (via drill 1.1 pad 1.78)
  other vias: 46.99,6.35
N$26  (via drill 1.1 pad 1.78)
  other vias: 41.91,6.35
N$27  (via drill 1.1 pad 1.78)
  other vias: 41.91,8.89
N$28  (via drill 1.1 pad 1.78)
  other vias: 41.91,11.43
N$29  (via drill 1.1 pad 1.78)
  other vias: 41.91,13.97
N$30  (via drill 1.1 pad 1.78)
  other vias: 41.91,16.51
N$31  (via drill 1.1 pad 1.78)
  other vias: 39.37,16.51
N$32  (via drill 1.1 pad 1.78)
  other vias: 39.37,13.97
N$33  (via drill 1.1 pad 1.78)
  other vias: 39.37,11.43
N$34  (via drill 1.1 pad 1.78)
  other vias: 39.37,8.89
N$35  (via drill 1.1 pad 1.78)
  other vias: 39.37,6.35
N$36  (via drill 1.1 pad 1.78)
  other vias: 36.83,6.35
N$37  (via drill 1.1 pad 1.78)
  other vias: 36.83,8.89
N$38  (via drill 1.1 pad 1.78)
  other vias: 36.83,11.43
N$39  (via drill 1.1 pad 1.78)
  other vias: 36.83,13.97
N$40  (via drill 1.1 pad 1.78)
  other vias: 36.83,16.51
N$41
  Top 0.254: IC1.16 21.78,6.22 C7.1
N$45  (via drill 1.1 pad 1.78)
  other vias: 49.53,6.35
RESET  (via drill 0.5)
  Top 0.254: JP1.16 6.48,1.27 8.26,3.05 8.79,3.05 | IC2.29 29.46,9.14 28.83,8.51 28.32,8.51 28.13,8.32 v27.81,8.32 | 8.79,3.05 10.1,3.05 v10.16,3.11 | SW2.B' 8.79,7.09 9.34,6.54 9.34,5.14 8.79,4.6 SW2.B 8.79,3.05 | C5.2 21.02,12.85 v21.02,14.03 | R8.1 25.93,18.44 v26.04,18.54
  Bottom 0.254: v10.16,3.11 10.16,3.68 11.18,4.7 11.18,6.86 9.46,8.57 9.46,10.79 11.81,10.79 12.57,10.03 13.53,10.03 14.73,11.24 17.46,11.24 18.73,12.51 20.19,12.51 | v26.04,18.54 24.89,17.4 24.89,16.38 24.38,15.88 22.73,15.88 21.02,14.16 v21.02,14.03 21.02,13.34 20.19,12.51 | v27.81,8.32 22.04,8.32 20.45,9.91 20.45,12.19 20.19,12.45 20.19,12.51
RXD
  Top 0.254: IC1.21 18.86,9.14 19.11,9.4 20.07,9.4 20.83,10.16 22.16,10.16 22.71,10.71 R1.2
RXLED  (via drill 0.5)
  Top 0.254: IC1.13 20.94,4.38 v21.65,4.38 | D1.C 26.31,4.38 v26.12,4.57
  Bottom 0.254: v21.65,4.38 25.93,4.38 v26.12,4.57
TXLED  (via drill 0.5)
  Top 0.254: IC1.14 22.36,5.22 v22.42,5.27 | D5.C 26.25,6.03 v26.12,5.91
  Bottom 0.254: v26.12,5.91 25.74,5.52 22.67,5.52 v22.42,5.27
VBAT
  Top 0.254: 11.68,16.26 11.94,16
  Top 0.305: 14.29,10.16 14.31,10.14 R5.2 14.35,10.01 14.35,9.4 14.54,9.21 15.62,9.21 15.81,9.4 15.81,10.54 15.94,10.67 U3.3
  Top 0.406: X1.2 11.94,15.75 | 11.94,15.75 11.94,16 | 11.68,16.89 11.68,16.26 | 11.94,15.75 11.94,14.22 13.76,14.22 14.03,13.95 Q3.3 14.03,10.92 14.29,10.67 14.29,10.16 14.29,10.01 | 15.93,18.8 16.12,18.98
  Top 0.61: 11.68,16.89 12.7,17.91 14.79,17.91 15.86,18.98 16.12,18.98 | 16.12,18.98 C3.1 | 16.12,18.98 16.51,19.38 JP3.1
VBUS  (via drill 0.5)
  Top 0.254: v26.16,3.17 30.16,3.17 30.64,3.65 32.23,3.65 32.64,4.06 32.64,4.55 R7.2 R6.2 | IC1.8 17.86,3.3 17.6,3.05 16.32,3.05 15.86,3.5 v15.43,3.5 | CHG.A 0.89,6.06 0.89,13.14 0.95,13.21 3.62,13.21 4.1,12.73 X4.VBUS | C8.2 8.39,13.74 8.36,13.74
  Top 0.305: IC1.7 IC1.8
  Top 0.381: X4.VBUS 6.83,12.73
  Top 0.406: 6.83,12.73 7.37,12.19 D4.A 8,12.19 | Q3.1 12.89,11.25 12.89,10.86 12.61,10.57 R5.4 12.39,9.84 v11.24,9.84 | U3.4 19.3,10.77 v19.3,11.63
  Top 0.61: v9.4,19.68 9.4,19.46 8.51,18.57 8.51,13.88 8.36,13.74 7.87,13.24 D4.A | 8,12.19 8.38,12.19 10.73,9.84 v11.24,9.84
  Bottom 0.254: v26.16,3.17 17.03,3.17 16.7,3.5 v15.43,3.5
  Bottom 0.406: v15.43,3.5 15.23,3.5 12.7,6.03 12.7,9.34 | 12.7,9.34 11.75,9.34 v11.24,9.84 | 12.7,9.34 13.72,9.34 15.05,10.67 18.73,10.67 19.3,11.24 v19.3,11.63
  Bottom 0.61: JP3.3 20.95,21.59 19.56,20.19 9.91,20.19 v9.4,19.68
XTAL1
  Top 0.254: IC2.8 31.75,15.15 31.75,16.38 32.34,16.98 Y2.3
XTAL2
  Top 0.254: IC2.7 32.11,14.46 32.63,14.98 Y2.1

### Text on the board
tPlace: BAT | EN | USB | 4 | 3 | 2 | 10 | 9 | 6 | 5 | SCL | SDA | #13 | Feather / 328P | 3.3V | reset | RX | CHG | TX | GND | MOSI | MISO | RST | 3V | AR | GND | A0 | A1 | A2 | A3 | A6 | A7 | SCK | RX | TX | 7
bPlace: 3.7/4.2V / LiPoly Batt / µUSB charge | ~ | BAT | En | USB | 4 | 3~ | 2 | 10~ | 9~ | 6~ | 5 | SCL | SDA | Feather 328p / ATmega328p | 8MHz & 3.3V | RST | 3V | Aref | GND | A0 | A1 | A2 | A3 | A6 | A7 | SCK | MOSI | MISO | RX | TX | 7